# Altium project nRF52832_extend.PrjPcb
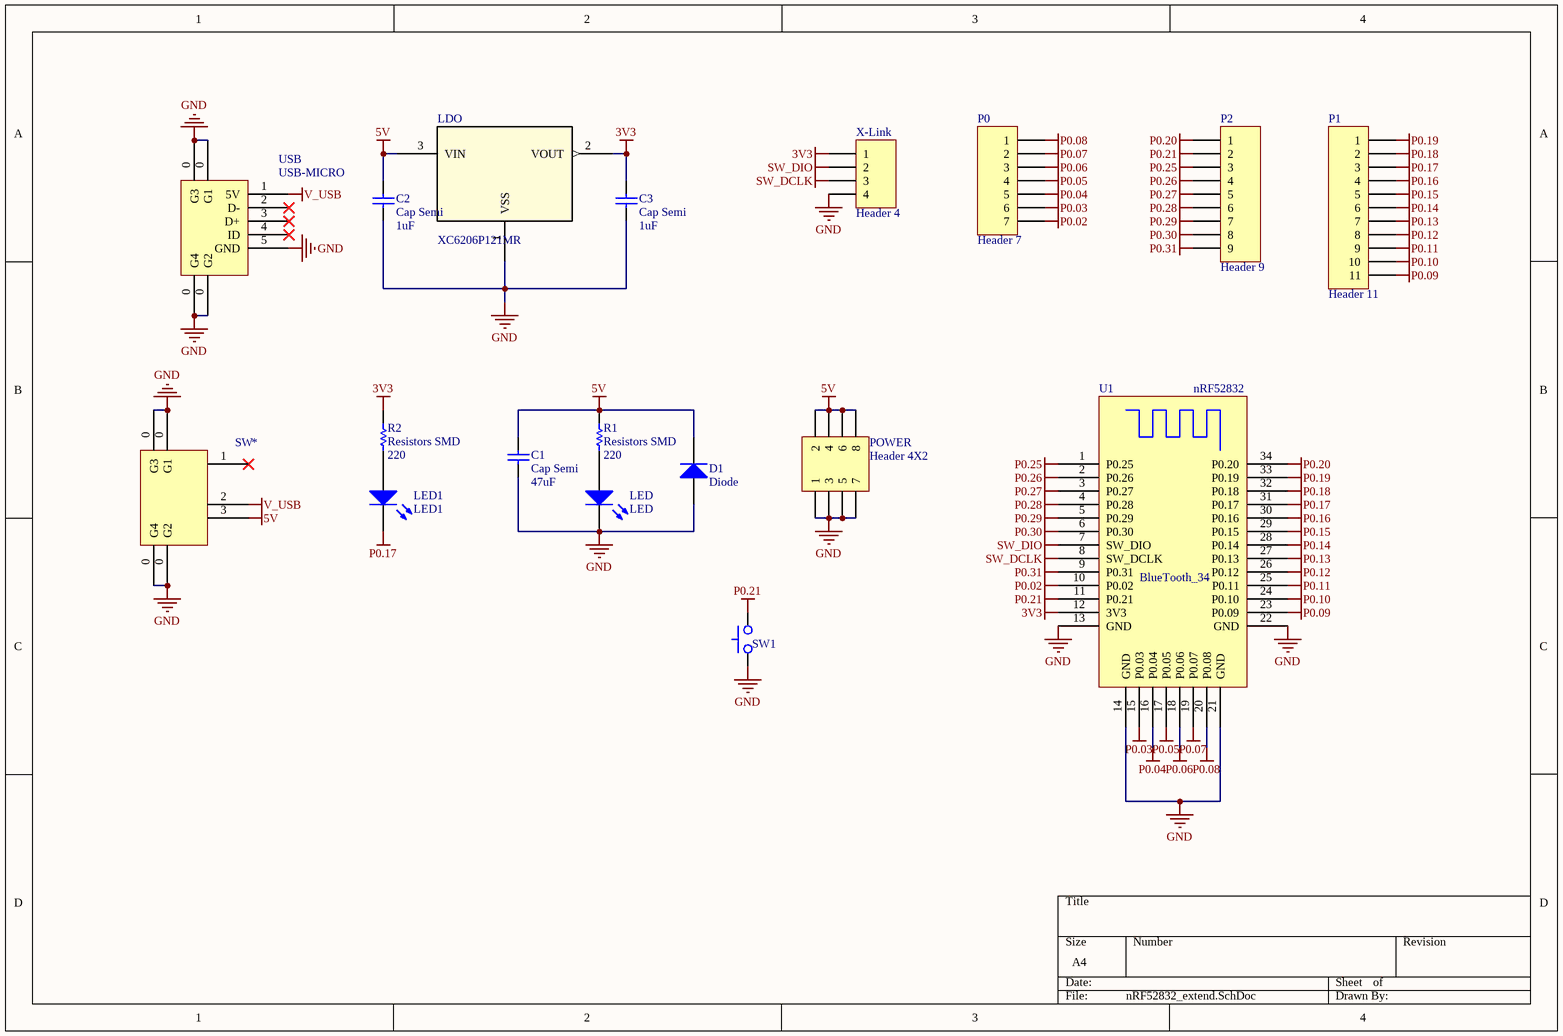
[diagram p0: nRF52832_extend.SchDoc]
1 sheet, 18 parts. Net scope: global (net labels, ports and power ports of the same name join across sheets).
Board file: nRF52832_extend.PcbDoc

## Sheet nRF52832_extend.SchDoc
size A4

### Parts
*  SW  [SW_mk12c02]
C1  Cap Semi  value 47uF  [C0805]
C2  Cap Semi  value 1uF  [C0805]
C3  Cap Semi  value 1uF  [C0805]
D1  Diode  [6-0805_M]
LDO  XC6206P121MR  [SOT-23]
LED  LED  [0805 2.0X1.25X1.1]
LED1  LED1  [0805 2.0X1.25X1.1]
P0  Header 7  [HDR1X7]
P1  Header 11  [HDR1X11]
P2  Header 9  [HDR1X9]
POWER  Header 4X2  [HDR2X4]
R1  Resistors SMD  value 220  [6-0805_M]
R2  Resistors SMD  value 220  [6-0805_M]
SW1  SW-PB  [SWITCH_SMD_6x3.5]  (value not drawn)
U1  nRF52832  [BlueTooth_34_SMD]
USB  USB-MICRO  [USB-MICRO]
X-Link  Header 4  [HDR1X4]

### Nets
3V3: C3.2 LDO.2(VOUT) R2.2 U1.12(3V3) X-Link.1
5V: *.3 C1.2 C2.2 D1.2(K) LDO.3(VIN) POWER.2 POWER.4 POWER.6 POWER.8 R1.2
GND: *.0(G1) C1.1 C2.1 C3.1 D1.1(A) LDO.1(VSS) LED.2(K) POWER.1 POWER.3 POWER.5 POWER.7 SW1.2 U1.13(GND) U1.14(GND) U1.21(GND) U1.22(GND) USB.0(G1) USB.5(GND) X-Link.4
P0.02: P0.7 U1.10(P0.02)
P0.03: P0.6 U1.15(P0.03)
P0.04: P0.5 U1.16(P0.04)
P0.05: P0.4 U1.17(P0.05)
P0.06: P0.3 U1.18(P0.06)
P0.07: P0.2 U1.19(P0.07)
P0.08: P0.1 U1.20(P0.08)
P0.09: P1.11 U1.23(P0.09)
P0.10: P1.10 U1.24(P0.10)
P0.11: P1.9 U1.25(P0.11)
P0.12: P1.8 U1.26(P0.12)
P0.13: P1.7 U1.27(P0.13)
P0.14: P1.6 U1.28(P0.14)
P0.15: P1.5 U1.29(P0.15)
P0.16: P1.4 U1.30(P0.16)
P0.17: LED1.2(K) P1.3 U1.31(P0.17)
P0.18: P1.2 U1.32(P0.18)
P0.19: P1.1 U1.33(P0.19)
P0.20: P2.1 U1.34(P0.20)
P0.21: P2.2 SW1.1 U1.11(P0.21)
P0.25: P2.3 U1.1(P0.25)
P0.26: P2.4 U1.2(P0.26)
P0.27: P2.5 U1.3(P0.27)
P0.28: P2.6 U1.4(P0.28)
P0.29: P2.7 U1.5(P0.29)
P0.30: P2.8 U1.6(P0.30)
P0.31: P2.9 U1.9(P0.31)
SW_DCLK: U1.8(SW_DCLK) X-Link.3
SW_DIO: U1.7(SW_DIO) X-Link.2
V_USB: *.2 USB.1(5V)
NetLED1_1: LED1.1(A) R2.1
NetLED_1: LED.1(A) R1.1

Not connected (* = marked no-connect by the designer): * 1*; USB 2(D-)* 3(D+)* 4(ID)*

### Notes on the sheet
- (in symbol nRF52832) BlueTooth_34

### Library data of the parts
* = SW_mk12c02
C1-C3 = Cap Semi: Capacitor (Semiconductor SIM Model); Published: 8-Jun-2000; LatestRevisionDate: 29-May-2009; LatestRevisionNote: IPC-7351 Footprint Added.; PackageReference: C1206; Publisher: Altium Limited; PackageDescription: Chip Capacitor
D1 = Diode: Default Diode; Published: 8-Jun-2000; LatestRevisionDate: 17-Jul-2002; LatestRevisionNote: Re-released for DXP Platform.; PackageVersion: Sep-1996; PackageReference: SMC; Publisher: Altium Limited; PackageDescription: DO-214-AB/SMC; 2 C-Bend Leads; Body 7.9 x 5.9 mm, inc. leads (LxW); Code_JEDEC: DO-214-AB
LDO = XC6206P121MR: Imported; Vendor: Torex Semiconductor; Built_By: EMA_UL_Team; C: Copyright (C) 2016 Accelerated Designs. All rights reserved; Manufacturer_Part_Number: XC6206P121MR; RefDes: RefDes; Type: DEV; Value: Value
LED LED1 = LED: Typical INFRARED GaAs LED; Published: 8-Jun-2000; LatestRevisionDate: 08-Jul-2005; LatestRevisionNote: Mech Layer 1 removed.; PackageReference: LED-0; Publisher: Altium Limited; PackageDescription: LED; 2 Leads
P0 = Header 7: Header, 7-Pin; LatestRevisionDate: 17-Jul-2002; LatestRevisionNote: Re-released for DXP Platform.; Publisher: Altium Limited
P1 = Header 11: Header, 11-Pin; LatestRevisionDate: 17-Jul-2002; LatestRevisionNote: Re-released for DXP Platform.; Publisher: Altium Limited
P2 = Header 9: Header, 9-Pin; LatestRevisionDate: 17-Jul-2002; LatestRevisionNote: Re-released for DXP Platform.; Publisher: Altium Limited
POWER = Header 4X2: Header, 4-Pin, Dual row; LatestRevisionDate: 17-Jul-2002; LatestRevisionNote: Re-released for DXP Platform.; Publisher: Altium Limited
R1 R2 = Resistors SMD: Resistor
SW1 = SW-PB: 按鈕開關; Published: 24-Mar-1999; LatestRevisionDate: 17-Jul-2002; LatestRevisionNote: Re-released for DXP Platform.; PackageReference: SPST-2; Publisher: Altium Limited
X-Link = Header 4: Header, 4-Pin; LatestRevisionDate: 17-Jul-2002; LatestRevisionNote: Re-released for DXP Platform.; Publisher: Altium Limited